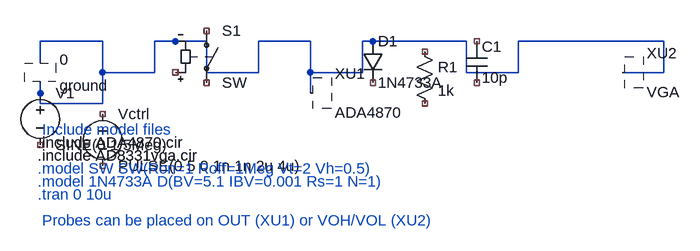
[diagram p0: schematic ultrasound_system_complete_ready.asc]
ultrasound_system_complete_ready.asc, the LTspice schematic file:
Version 4
SHEET 1 1152 884
WIRE 64 96 64 64
WIRE 64 64 160 64
WIRE 160 64 160 112
WIRE 160 112 240 112
WIRE 240 112 240 64
WIRE 240 64 320 64
WIRE 320 64 320 112
WIRE 320 112 400 112
WIRE 400 112 400 64
WIRE 400 64 480 64
WIRE 480 64 480 112
WIRE 480 112 560 112
WIRE 560 112 560 64
WIRE 560 64 640 64
WIRE 640 64 720 64
WIRE 720 64 720 112
WIRE 720 112 800 112
WIRE 800 112 800 64
WIRE 800 64 880 64
WIRE 64 128 64 160
WIRE 64 160 160 160
WIRE 160 160 160 112
WIRE 880 64 960 64
WIRE 960 64 1024 64
WIRE 480 144 480 112
WIRE 1024 64 1024 112
WIRE 1024 112 960 112

SYMBOL voltage 64 128 R0
SYMATTR InstName V1
SYMATTR Value SINE(0 1 5Meg)

SYMBOL sw 320 32 R0
SYMATTR InstName S1
SYMATTR Value SW

SYMBOL diode 560 64 R0
SYMATTR InstName D1
SYMATTR Value 1N4733A

SYMBOL res 640 64 R0
SYMATTR InstName R1
SYMATTR Value 1k

SYMBOL cap 720 64 R0
SYMATTR InstName C1
SYMATTR Value 10p

SYMBOL voltage 160 160 R0
SYMATTR InstName Vctrl
SYMATTR Value PULSE(0 5 0 1n 1n 2u 4u)

SYMBOL ground 64 160 R0
SYMATTR InstName 0

SYMBOL ADA4870 400 0 R0
SYMATTR InstName XU1
SYMATTR Value ADA4870

SYMBOL VGA 880 0 R0
SYMATTR InstName XU2
SYMATTR Value VGA

TEXT 60 200 Left 2 ; Include model files
TEXT 60 220 Left 2 !.include ADA4870.cir
TEXT 60 240 Left 2 !.include AD8331vga.cir
TEXT 60 260 Left 2 .model SW SW(Ron=1 Roff=1Meg Vt=2 Vh=0.5)
TEXT 60 280 Left 2 .model 1N4733A D(BV=5.1 IBV=0.001 Rs=1 N=1)
TEXT 60 300 Left 2 .tran 0 10u

TEXT 60 340 Left 2 ; Probes can be placed on OUT (XU1) or VOH/VOL (XU2)

The netlist it stands for:
* ultrasound_system_complete_ready.asc
V1 N001 NC_01 SINE(0 1 5Meg)
S1 NC_02 NC_03 NC_04 N001 SW
D1 N001 NC_05 1N4733A
R1 NC_06 NC_07 1k
C1 NC_08 NC_09 10p
Vctrl NC_10 NC_11 PULSE(0 5 0 1n 1n 2u 4u)
* 0: ground (symbol ground not available, pin order unknown); nets seen at it: N001
* XU1: ADA4870 (symbol ADA4870 not available, pin order unknown); nets seen at it: N001
* XU2: VGA (symbol VGA not available, pin order unknown); nets seen at it: N001
.model D D
.lib standard.dio
*  Include model files
.include ADA4870.cir
.include AD8331vga.cir
* .model SW SW(Ron=1 Roff=1Meg Vt=2 Vh=0.5)
* .model 1N4733A D(BV=5.1 IBV=0.001 Rs=1 N=1)
* .tran 0 10u
*  Probes can be placed on OUT (XU1) or VOH/VOL (XU2)
.backanno
.end